# Altium schematic sheet DE-020717_2.SchDoc: COM & WIFI
size A3; Author: eldar6776@hotmail.com; DrawnBy: Eldar Dedic; Organization: I-MEDIA GROUP d.o.o.; Address1: Topal Osman Paše 18; Address2: Sarajevo 71000; Address3: Federacija BiH; Address4: Bosna i Hercegovina; DocumentNumber: DE-020717; Revision: 001
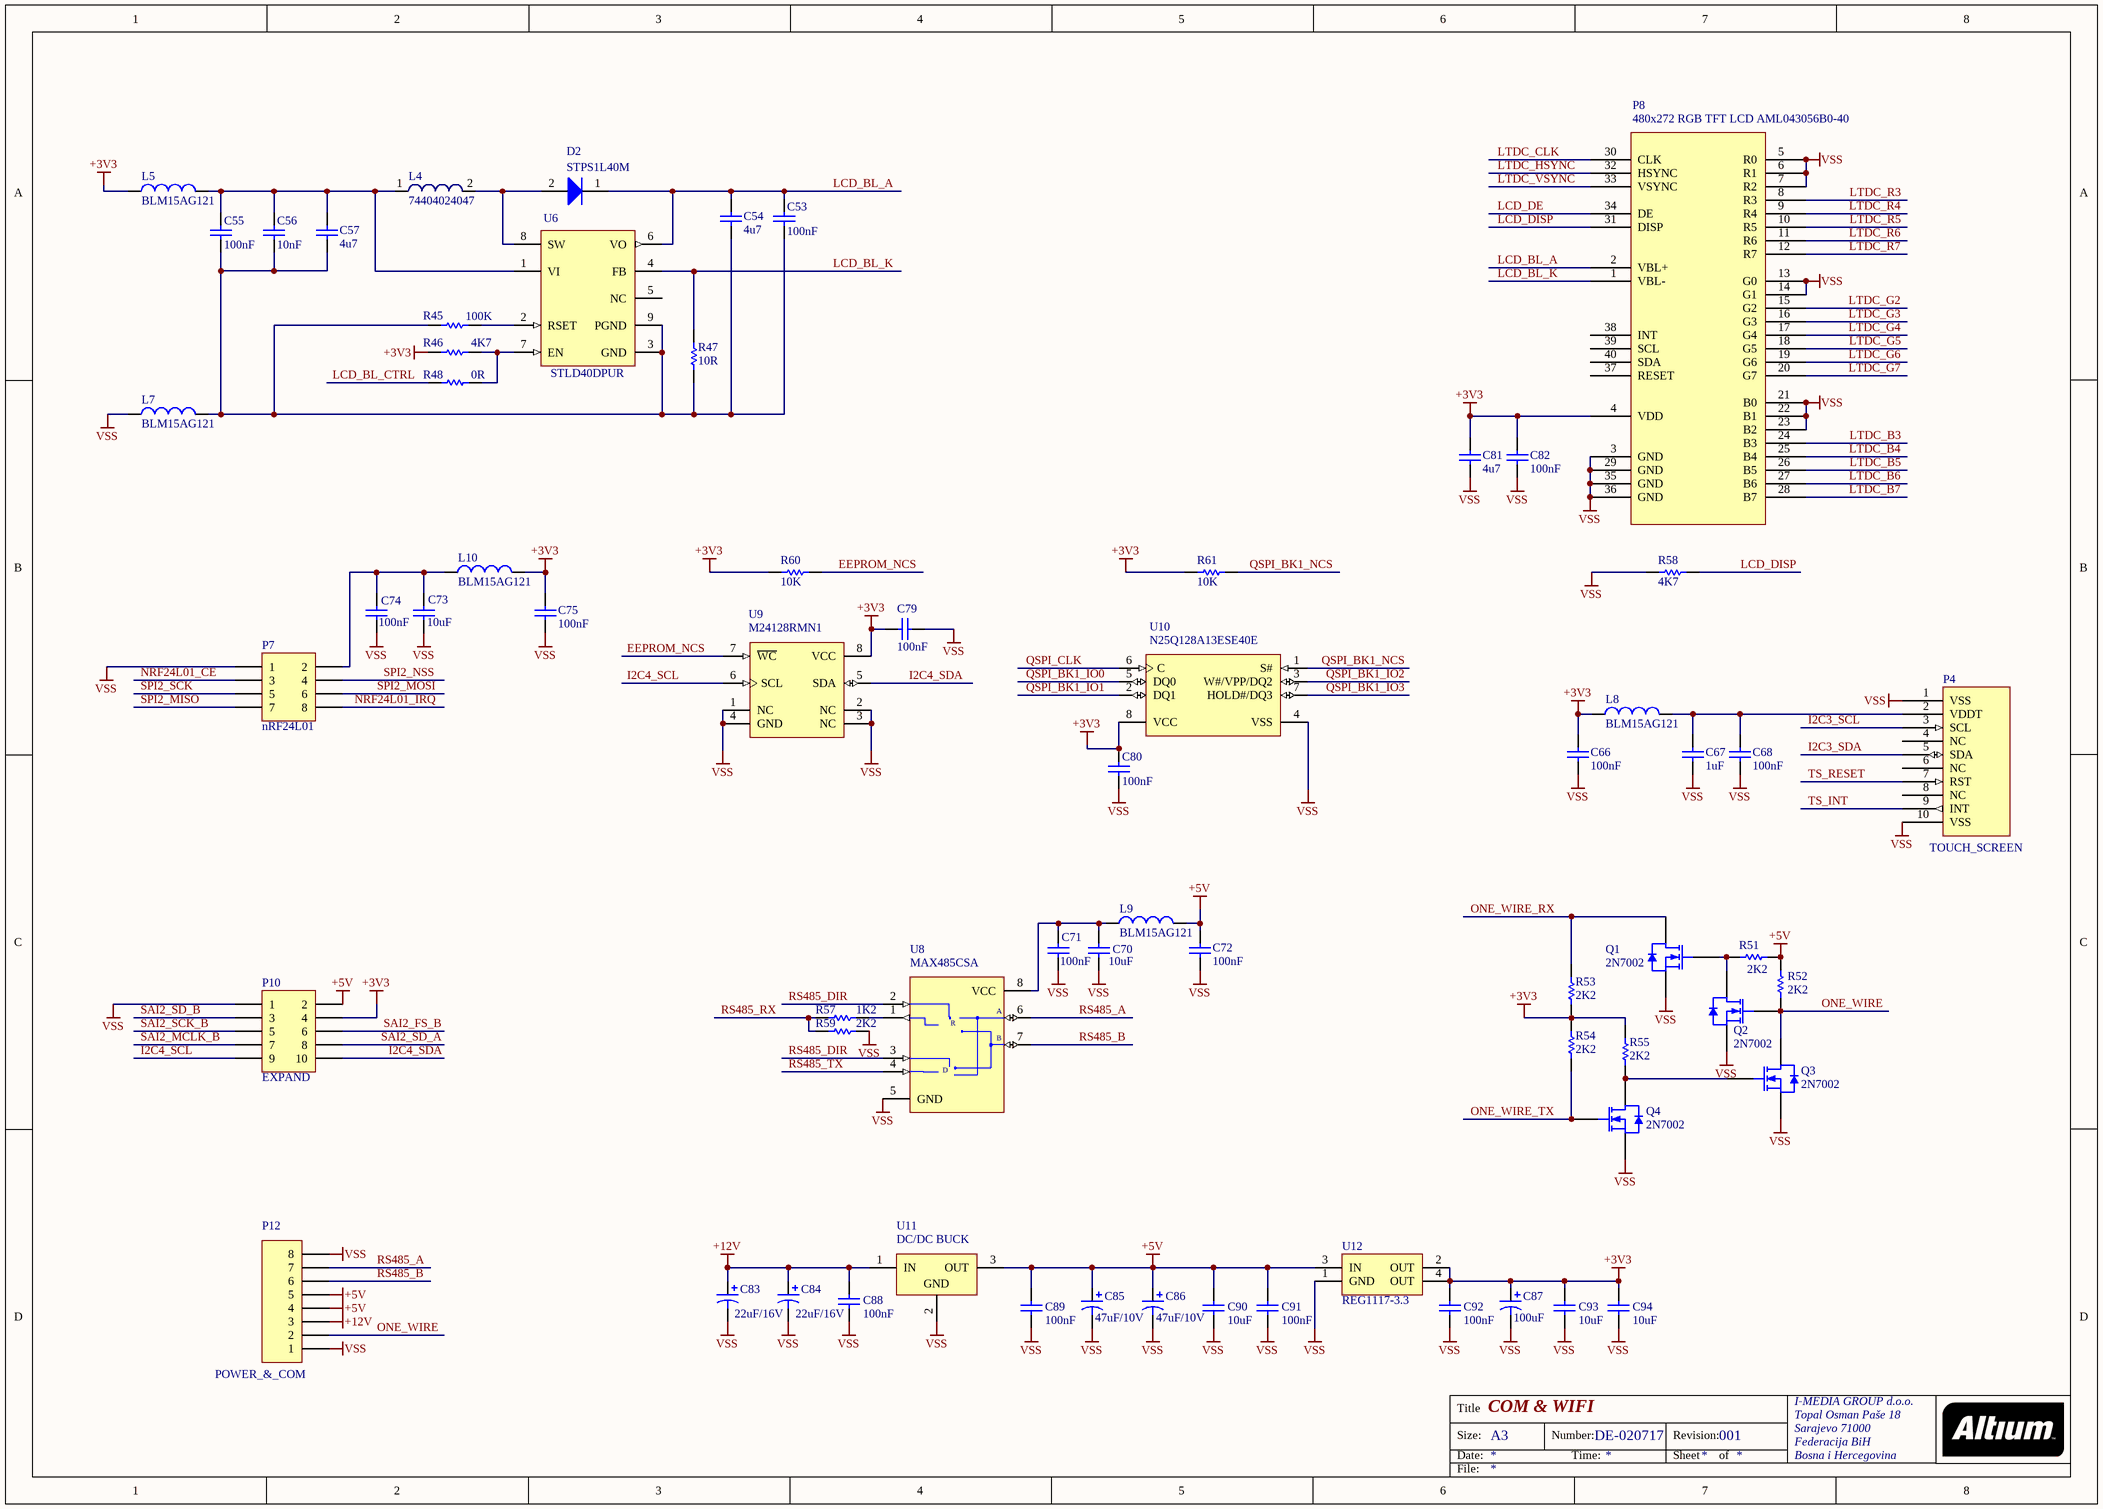
[diagram p0: DE-020717_2.SchDoc]

## Parts
C53  100nF  [0603]
C54  4u7  [0805]
C55  100nF  [0603]
C56  value 10nF  [0603]  (hidden comment: 100nF)
C57  4u7  [0805]
C66  100nF  [0603]
C67  1uF  [0603]
C68  100nF  [0603]
C70  value 10uF  [0805]  (hidden comment: 4u7)
C71  100nF  [0603]
C72  100nF  [0603]
C73  value 10uF  [0805]  (hidden comment: 4u7)
C74  100nF  [0603]
C75  100nF  [0603]
C79  100nF  [0603]
C80  100nF  [0603]
C81  4u7  [0805]
C82  100nF  [0603]
C83  22uF/16V  [3528]
C84  22uF/16V  [3528]
C85  47uF/10V  [3528]
C86  47uF/10V  [3528]
C87  100uF  [3528]
C88  100nF  [0603]
C89  100nF  [0603]
C90  10uF  [0805]
C91  100nF  [0603]
C92  100nF  [0603]
C93  10uF  [0805]
C94  10uF  [0805]
D2  STPS1L40M  [ONSC-SOD-123-2-425-04_V]
L4  74404024047  [WE-LQS 252012]
L5  BLM15AG121  [0603]
L7  BLM15AG121  [0603]
L8  BLM15AG121  [0603]
L9  BLM15AG121  [0603]
L10  BLM15AG121  [0603]
P4  TOUCH_SCREEN  [10 pin PFC]
P7  nRF24L01  [HDR2X4]
P8  480x272 RGB TFT LCD AML043056B0-40  [40 pin FPC]
P10  EXPAND  [HDR2X5]
P12  POWER_&_COM  [HDR1X8]
Q1  2N7002  [SOT23_N]
Q2  2N7002  [SOT23_N]
Q3  2N7002  [SOT23_N]
Q4  2N7002  [SOT23_N]
R45  100K  [ERA-0603]
R46  4K7  [ERA-0603]
R47  10R  [ERA-0805]
R48  0R  [ERA-0603]
R51  2K2  [ERA-0603]
R52  2K2  [ERA-0603]
R53  2K2  [ERA-0603]
R54  2K2  [ERA-0603]
R55  2K2  [ERA-0603]
R57  1K2  [ERA-0603]
R58  4K7  [ERA-0603]
R59  2K2  [ERA-0603]
R60  10K  [ERA-0603]
R61  10K  [ERA-0603]
U6  STLD40DPUR  [QFN8_V]
U8  MAX485CSA  [NSO8_N]
U9  M24128RMN1  [SOP8_N]
U10  N25Q128A13ESE40E  [MICT-SE-8_N]
U11  DC/DC BUCK  [TO220]
U12  REG1117-3.3  [ZZ311]

## Nets
+3V3: C66.2 C75.2 C79.2 C80.1 C81.2 C82.2 C87.1 C92.2 C93.2 C94.2 L5.1 L8.1 L10.2 P8.4(VDD) P10.4 R46.2 R53.1 R54.2 R55.2 R60.1 R61.1 U9.8(VCC) U10.8(VCC) U12.2(OUT) U12.4(OUT)
+5V: C72.2 C85.1 C86.1 C89.2 C90.2 C91.2 L9.2 P10.2 P12.4 P12.5 R51.1 R52.2 U11.3(OUT) U12.3(IN)
+12V: C83.1 C84.1 C88.2 P12.3 U11.1(IN)
VSS: C66.1 C67.1 C68.1 C70.1 C71.1 C72.1 C73.1 C74.1 C75.1 C79.1 C80.2 C81.1 C82.1 C83.2 C84.2 C85.2 C86.2 C87.2 C88.1 C89.1 C90.1 C91.1 C92.1 C93.1 C94.1 L7.1 P4.1(VSS) P4.10(VSS) P7.1 P8.3(GND) P8.5(R0) P8.6(R1) P8.7(R2) P8.13(G0) P8.14(G1) P8.21(B0) P8.22(B1) P8.23(B2) P8.29(GND) P8.35(GND) P8.36(GND) P10.1 P12.1 P12.8 Q1.2(S) Q2.2(S) Q3.2(S) Q4.2(S) R58.1 R59.2 U8.5(GND) U9.1(NC) U9.2(NC) U9.3(NC) U9.4(GND) U10.4(VSS) U11.2(GND) U12.1(GND)
EEPROM_NCS: R60.2 U9.7(~{WC})
I2C3_SCL: P4.3(SCL)
I2C3_SDA: P4.5(SDA)
I2C4_SCL: P10.9 U9.6(SCL)
I2C4_SDA: P10.10 U9.5(SDA)
LCD_BL_A: C53.1 C54.2 D2.1(K) P8.2(VBL+) U6.6(VO)
LCD_BL_CTRL: R48.2
LCD_BL_K: P8.1(VBL-) R47.2 U6.4(FB)
LCD_DE: P8.34(DE)
LCD_DISP: P8.31(DISP) R58.2
LTDC_B3: P8.24(B3)
LTDC_B4: P8.25(B4)
LTDC_B5: P8.26(B5)
LTDC_B6: P8.27(B6)
LTDC_B7: P8.28(B7)
LTDC_CLK: P8.30(CLK)
LTDC_G2: P8.15(G2)
LTDC_G3: P8.16(G3)
LTDC_G4: P8.17(G4)
LTDC_G5: P8.18(G5)
LTDC_G6: P8.19(G6)
LTDC_G7: P8.20(G7)
LTDC_HSYNC: P8.32(HSYNC)
LTDC_R3: P8.8(R3)
LTDC_R4: P8.9(R4)
LTDC_R5: P8.10(R5)
LTDC_R6: P8.11(R6)
LTDC_R7: P8.12(R7)
LTDC_VSYNC: P8.33(VSYNC)
NRF24L01_CE: P7.3
NRF24L01_IRQ: P7.8
ONE_WIRE: P12.2 Q2.1(G) Q3.3(D) R52.1
ONE_WIRE_RX: Q1.3(D) R53.2
ONE_WIRE_TX: Q4.1(G) R54.1
QSPI_BK1_IO0: U10.5(DQ0)
QSPI_BK1_IO1: U10.2(DQ1)
QSPI_BK1_IO2: U10.3(W#/VPP/DQ2)
QSPI_BK1_IO3: U10.7(HOLD#/DQ3)
QSPI_BK1_NCS: R61.2 U10.1(S#)
QSPI_CLK: U10.6(C)
RS485_A: P12.7 U8.6(A)
RS485_B: P12.6 U8.7(B)
RS485_DIR: U8.2(~{RE}) U8.3(DE)
RS485_RX: R57.1 R59.1
RS485_TX: U8.4(DI)
SAI2_FS_B: P10.6
SAI2_MCLK_B: P10.7
SAI2_SCK_B: P10.5
SAI2_SD_A: P10.8
SAI2_SD_B: P10.3
SPI2_MISO: P7.7
SPI2_MOSI: P7.6
SPI2_NSS: P7.4
SPI2_SCK: P7.5
TS_INT: P4.9(INT)
TS_RESET: P4.7(RST)
NetC53_2: C53.2 C54.1 C55.2 C56.2 C57.2 L7.2 R45.2 R47.1 U6.3(GND) U6.9(PGND)
NetC55_1: C55.1 C56.1 C57.1 L4.1 L5.2 U6.1(VI)
NetC67_2: C67.2 C68.2 L8.2 P4.2(VDDT)
NetC70_2: C70.2 C71.2 L9.1 U8.8(VCC)
NetC73_2: C73.2 C74.2 L10.1 P7.2
NetD2_2: D2.2(A) L4.2 U6.8(SW)
NetQ1_1: Q1.1(G) Q2.3(D) R51.2
NetQ3_1: Q3.1(G) Q4.3(D) R55.1
NetR45_1: R45.1 U6.2(RSET)
NetR46_1: R46.1 R48.1 U6.7(EN)
NetR57_2: R57.2 U8.1(RO)

Not connected (* = marked no-connect by the designer): P4 4(NC) 6(NC) 8(NC); P8 37(RESET) 38(INT) 39(SCL) 40(SDA); U6 5(NC)

## Notes on the sheet
- Title
- Size:
- Date:
- A3
- Number:
- Time:
- Revision:
- Sheet
- of
- File:
- (in symbol MAX485CSA) R; D

## Library data of the parts
C53 C55 C56 C66 C68 C71 C72 C74 C75 C79 C80 C82 C88 C89 C91 C92 = C0603: Ceramic Chip Capacitor - Standard; Note: Footprint corresponds to dimensions for bulk cassette packaging. This case size has tightened tolerances.; Published: 17-Jul-2002; LatestRevisionDate: 19-Mar-2004; LatestRevisionNote: Silkscreen size reduced.; DatasheetDocument: Mar-2001; PackageDocument: Mar-2001; PackageReference: 0603; Publisher: Altium Limited; Code_JEITA: 0603; Code_IPC: 1608 [0603]; ComponentLink1Description: Manufacturer Link; ComponentLink1URL: http://www.kemet.com/; ComponentLink2Description: Datasheet; ComponentLink2URL: http://www.kemet.com/kemet/web/homepage/kechome.nsf/vapubfilesname/F3102TA.pdf/$file/F3102TA.pdf
  C53 C55 C66 C68 C71 C72 C74 C75 C79 C80 C82 C88 C89 C91 C92: Value: 100nF
C54 C57 C70 C73 C81 C90 C93 C94 = C0805: Ceramic Chip Capacitor - Standard; Note: Footprint corresponds to dimensions for bulk cassette packaging. This case size has tightened tolerances.; Published: 17-Jul-2002; LatestRevisionDate: 19-Mar-2004; LatestRevisionNote: Silkscreen size reduced.; DatasheetDocument: Mar-2001; PackageDocument: Mar-2001; PackageReference: 0805; Publisher: Altium Limited; Code_JEITA: 0805; Code_IPC: 2012[0805]; ComponentLink1Description: Manufacturer Link; ComponentLink1URL: http://www.kemet.com/; ComponentLink2Description: Datasheet; ComponentLink2URL: http://www.kemet.com/kemet/web/homepage/kechome.nsf/vapubfilesname/F3102TA.pdf/$file/F3102TA.pdf
  C54 C57 C81: Value: 4u7
  C90 C93 C94: Value: 10uF
C67 = C0603: Ceramic Chip Capacitor - Standard; Note: Footprint corresponds to dimensions for bulk cassette packaging. This case size has tightened tolerances.; Value: 100nF; Published: 17-Jul-2002; LatestRevisionDate: 19-Mar-2004; LatestRevisionNote: Silkscreen size reduced.; DatasheetDocument: Mar-2001; PackageDocument: Mar-2001; PackageReference: 0603; Publisher: Altium Limited; Code_JEITA: 0603; Code_IPC: 1608 [0603]; ComponentLink1Description: Manufacturer Link; ComponentLink1URL: http://www.kemet.com/; ComponentLink2Description: Datasheet; ComponentLink2URL: http://www.kemet.com/kemet/web/homepage/kechome.nsf/vapubfilesname/F3102TA.pdf/$file/F3102TA.pdf
C83-C86 = 293D156X0004B2: Tantamount Commercial, Surface Mount Solid Tantalum Chip Capacitor: 15uF, 20% Tolerance, 4 WVDC @ +85°C, Surge = 5.2V; Note: See Data Sheet for full range of components; Published: 19-Mar-2004; DatasheetDocument: 05-Feb-2003; PackageReference: 3528; Publisher: Altium Limited; Code_JEITA: 3528; ComponentLink1Description: Manufacturer Link; ComponentLink1URL: http://www.vishay.com/; ComponentLink2Description: Datasheet; ComponentLink2URL: http://www.vishay.com/docs/40002/293d.pdf
  C83 C84: Value: 22uF/16V
  C85 C86: Value: 47uF/10V
C87 = 293D156X0004B2: Tantamount Commercial, Surface Mount Solid Tantalum Chip Capacitor: 15uF, 20% Tolerance, 4 WVDC @ +85°C, Surge = 5.2V; Note: See Data Sheet for full range of components; Value: 100uF/6,3V; Published: 19-Mar-2004; DatasheetDocument: 05-Feb-2003; PackageReference: 3528; Publisher: Altium Limited; Code_JEITA: 3528; ComponentLink1Description: Manufacturer Link; ComponentLink1URL: http://www.vishay.com/; ComponentLink2Description: Datasheet; ComponentLink2URL: http://www.vishay.com/docs/40002/293d.pdf
D2 = SMMSD301T1G: Schottky Barrier Diode, 2-Pin SOD-123, Pb-Free, Tape and Reel; Manufacturer: On Semiconductor; Configuration: Single; DatasheetVersion: Rev. 6; PackageVersion: Rev. G, 10/2009; PackageReference: SOD-123-2-425-04; PackageDescription: 2-Pin SOD, Body 1.6 x 2.69 mm; Supplier 1: Digi-Key; Supplier Part Number 1: SMMSD301T1G-ND; Supplier 2: Mouser; Supplier Part Number 2: 863-SMMSD301T1G; Packing: Tape and Reel; RoHS: TRUE; Mounting Technology: Surface Mount; PartNumber: SMMSD301T1G; ComponentLink1Description: Manufacturer URL; ComponentLink1URL: http://www.onsemi.com/; ComponentLink2Description: Datasheet; ComponentLink2URL: http://www.onsemi.cn/pub_link/Collateral/MMSD301T1-D.PDF; ComponentLink3Description: Package Specification; ComponentLink3URL: http://www.onsemi.com/pub_link/Collateral/425-04.PDF
L4 = 74404024047: WE-LQS SMD Power Inductor, L=4.7 µH; Inductance: 4.7 µH; PackageReference: WE-LQS 252012; PartNumber: 74404024047; ComponentLink1Description: Manufacturer URL; ComponentLink1URL: http://www.we-online.com; ComponentLink2Description: Datasheet; ComponentLink2URL: http://katalog.we-online.de/pbs/datasheet/74404024047.pdf
L5 L7-L10 = Inductor_SMD: Inductor; Code_IEC: 1005; Published: 8-Jun-2000; LatestRevisionDate: 29-May-2009; LatestRevisionNote: IPC-7351 Footprint Added.; PackageReference: 0402-A; Publisher: Altium Limited; PackageDescription: Chip Inductor; Code_JEITA: 0402
P4 = TS_Connector: 10 pin PFC connector bottom
P7 = Header 4X2: Header, 4-Pin, Dual row; LatestRevisionDate: 17-Jul-2002; LatestRevisionNote: Re-released for DXP Platform.; Publisher: Altium Limited
P8 = TFT LCD Connector: 40 pin pfc connector bottom
P10 = Header 5X2: Header, 5-Pin, Dual row; LatestRevisionDate: 17-Jul-2002; LatestRevisionNote: Re-released for DXP Platform.; Publisher: Altium Limited
P12 = Header 8: Header, 8-Pin; LatestRevisionDate: 17-Jul-2002; LatestRevisionNote: Re-released for DXP Platform.; Publisher: Altium Limited
Q1-Q4 = BSS123: N-channel Enhancement Mode Vertical D-MOSFET; Published: 17-Sep-2003; LatestRevisionDate: 12-Dec-2006; LatestRevisionNote: IPC-7351 Footprint Added.; DatasheetVersion: Apr-1995; PackageVersion: May-1999; PackageReference: SOT23; Publisher: Altium Limited; PackageDescription: 3-Pin SOT-23 Package 0.95 mm Pitch, 2.3 mm Lead Span; ComponentLink1Description: Manufacturer Link; ComponentLink1URL: http://www.semiconductors.philips.com/; ComponentLink2Description: Datasheet; ComponentLink2URL: http://www.semiconductors.philips.com/acrobat/datasheets/BSS123_3.pdf
R45 R46 R48 R51-R55 = ERAV: Metal Film Thermosensitive Chip Resistor, 0.56 Ohm to 10k Ohm Range, 5% Tolerance, 0603 Size, 0.063 W; Note: If flow soldering, adjust pad width of PCB Footprint to 0.7 - 0.8 times the width of the resistor.; Published: 17-Dec-2003; LatestRevisionDate: 19-Mar-2004; LatestRevisionNote: Silkscreen size reduced.; PackageDocument: Mar-2003; PackageReference: ERA-0603; Publisher: Altium Limited; Code_IPC: 1608 [0603]; ComponentLink1Description: Manufacturer Link; ComponentLink1URL: http://www.panasonic.com/industrial/components/resistive_products.htm; ComponentLink2Description: Datasheet; ComponentLink2URL: http://www.panasonic.com/industrial/components/pdf/AOF0000CE1.pdf
  R51 R52 R54 R55: Value: 2K2
R47 = ERAS: Metal Film Thermosensitive Chip Resistor, 0.56 Ohm to 10k Ohm Range, 5% Tolerance, 0805 Size, 0.1 W; Note: If flow soldering, adjust pad width of PCB Footprint to 0.7 - 0.8 times the width of the resistor.; Published: 17-Dec-2003; LatestRevisionDate: 19-Mar-2004; LatestRevisionNote: Silkscreen size reduced.; PackageDocument: Mar-2003; PackageReference: ERA-0805; Publisher: Altium Limited; Code_IPC: 2012 [0805]; ComponentLink1Description: Manufacturer Link; ComponentLink1URL: http://www.panasonic.com/industrial/components/resistive_products.htm; ComponentLink2Description: Datasheet; ComponentLink2URL: http://www.panasonic.com/industrial/components/pdf/AOF0000CE1.pdf
R57-R61 = ERA3Y: Rectangular Thick Film Chip Resistor, 10 Ohm to 330k Ohm Range, 0.1% and 0.5% Tolerance, 0603 Size, 0.063 W; Note: If flow soldering, adjust pad width of PCB Footprint to 0.7 - 0.8 times the width of the resistor.; Published: 17-Dec-2003; LatestRevisionDate: 19-Mar-2004; LatestRevisionNote: Silkscreen size reduced.; PackageDocument: Mar-2003; PackageReference: ERA-0603; Publisher: Altium Limited; Code_IPC: 1608 [0603]; ComponentLink1Description: Manufacturer Link; ComponentLink1URL: http://www.panasonic.com/industrial/components/resistive_products.htm; ComponentLink2Description: Datasheet; ComponentLink2URL: http://www.panasonic.com/industrial/components/pdf/AOA0000CE8.pdf
U6 = STLD40DPUR: White Led Power Supply For Large Display Backlight, 8-Pin VFDFPN, Tape and Reel; DatasheetVersion: May-2011; PackageVersion: 2011; PackageReference: QFN8; PackageDescription: 8-Pin Dual Flat No-Lead, 3 x 3 mm Body, 0.65 mm Pitch, Exposed Pad; ComponentLink1Description: Manufacturer URL; ComponentLink1URL: http://www.st.com; ComponentLink2Description: Datasheet; ComponentLink2URL: http://www.st.com/internet/com/TECHNICAL_RESOURCES/TECHNICAL_LITERATURE/DATASHEET/CD00098098.pdf
U8 = MAX485CSA: Low-Power, Slew-Rate-Limited RS-485/RS-422 Transceiver; Published: 16-Jan-2001; LatestRevisionDate: 13-Apr-2006; LatestRevisionNote: IPC-7351 Footprint Added.; DatasheetVersion: Feb-1996; PackageReference: NSO8; Publisher: Altium Limited; PackageDescription: 8-Pin Small Outline Integrated Circuit 1.27 mm Pitch; Code_JEDEC: MS-012-AA; Code_IPC: SOIC127P600-8; ComponentLink1Description: Manufacturer Link; ComponentLink1URL: http://www.maxim-ic.com/; ComponentLink2Description: Datasheet; ComponentLink2URL: http://pdfserv.maxim-ic.com/en/ds/MAX1487-MAX491.pdf
U9 = M24128RMN1: 128 K Serial I˛C Bus EEPROM; Published: 24-Aug-2001; LatestRevisionDate: 13-Apr-2006; LatestRevisionNote: IPC-7351 Footprint Added.; DatasheetVersion: Feb-1998; PackageVersion: Jul-1999; PackageReference: SOP8; Publisher: Altium Limited; PackageDescription: 8-Pin Small Outline Integrated Circuit 1.27 mm Pitch; ComponentLink1Description: Manufacturer Link; ComponentLink1URL: http://www.st.com/
U10 = N25Q128A13ESE40E: 128 Mb (x1/x2/x4) Serial NOR Flash Memory with Multi I/O, 108 MHz, 2.7 to 3.6 V, 8-pin SO8 Wide (SE), Tray; Part Family: N25Q; Manufacturer: Micron; Density: 128Mb; Speed: 108 MHz; Voltage: 2.7V-3.6V; DatasheetVersion: Rev. L; PackageVersion: Rev. E; PackageReference: MICT-SE-8; PackageDescription: 8-Pin SO Wide, 5.29 X 5.29 mm, Pitch 1.27 mm; Applications: Embedded; Package: SO8 Wide; Part Status: Production; RoHS: Yes; Type: Multi I/O; Width: x1/x2/x4; Mounting Technology: Surface Mount; PartNumber: N25Q128A13ESE40E; ComponentLink1Description: Manufacturer URL; ComponentLink1URL: http://www.micron.com/; ComponentLink2Description: Datasheet; ComponentLink2URL: http://www.micron.com/~/media/Documents/Products/Data%20Sheet/NOR%20Flash/Serial%20NOR/N25Q/n25q_128mb_3v_65nm.pdf; ComponentLink3Description: Package Specification; ComponentLink3URL: http://www.micron.com/~/media/Documents/Products/Data%20Sheet/NOR%20Flash/Serial%20NOR/N25Q/n25q_32mb_1_8v_65nm.pdf
U11 = L7805CV: Positive Voltage Regulator, 5V, 3-Pin TO-220; DatasheetVersion: Nov-2011; PackageVersion: ver3.0; PackageReference: TO220; PackageDescription: TO, Thru-Hole, Vertical, Heatsink Mounted; 3 In-Line Leads; Pitch 2.54 mm; PartNumber: L7805CV; ComponentLink1Description: Manufacturer URL; ComponentLink1URL: http://www.st.com; ComponentLink2Description: Datasheet; ComponentLink2URL: http://www.st.com/internet/com/TECHNICAL_RESOURCES/TECHNICAL_LITERATURE/DATASHEET/CD00000444.pdf; ComponentLink3Description: Package Specification; ComponentLink3URL: http://www.st.com/internet/com/TECHNICAL_RESOURCES/TECHNICAL_LITERATURE/PACKAGE_INFORMATION/CD00004649.pdf
U12 = REG1117-3.3: 800mA and 1A Low Dropout Positive Regulator 2.85V, 3.3V, 5V, and Adjustable; Published: 8-Jun-2000; LatestRevisionDate: 17-Jul-2002; LatestRevisionNote: Re-released for DXP Platform.; DatasheetVersion: Sep-1997; PackageVersion: revC; PackageReference: ZZ311; Publisher: Altium Limited; PackageDescription: SOT-223/SC-73; 4 Leads; Body 6.7 x 7.3 mm, inc. leads (LxW max); ComponentLink1Description: Manufacturer Link; ComponentLink1URL: http://www.ti.com/; ComponentLink2Description: Datasheet; ComponentLink2URL: http://www-s.ti.com/sc/ds/REG1117.pdf